# Altium schematic sheet conectic_to_girouette.SchDoc
size B
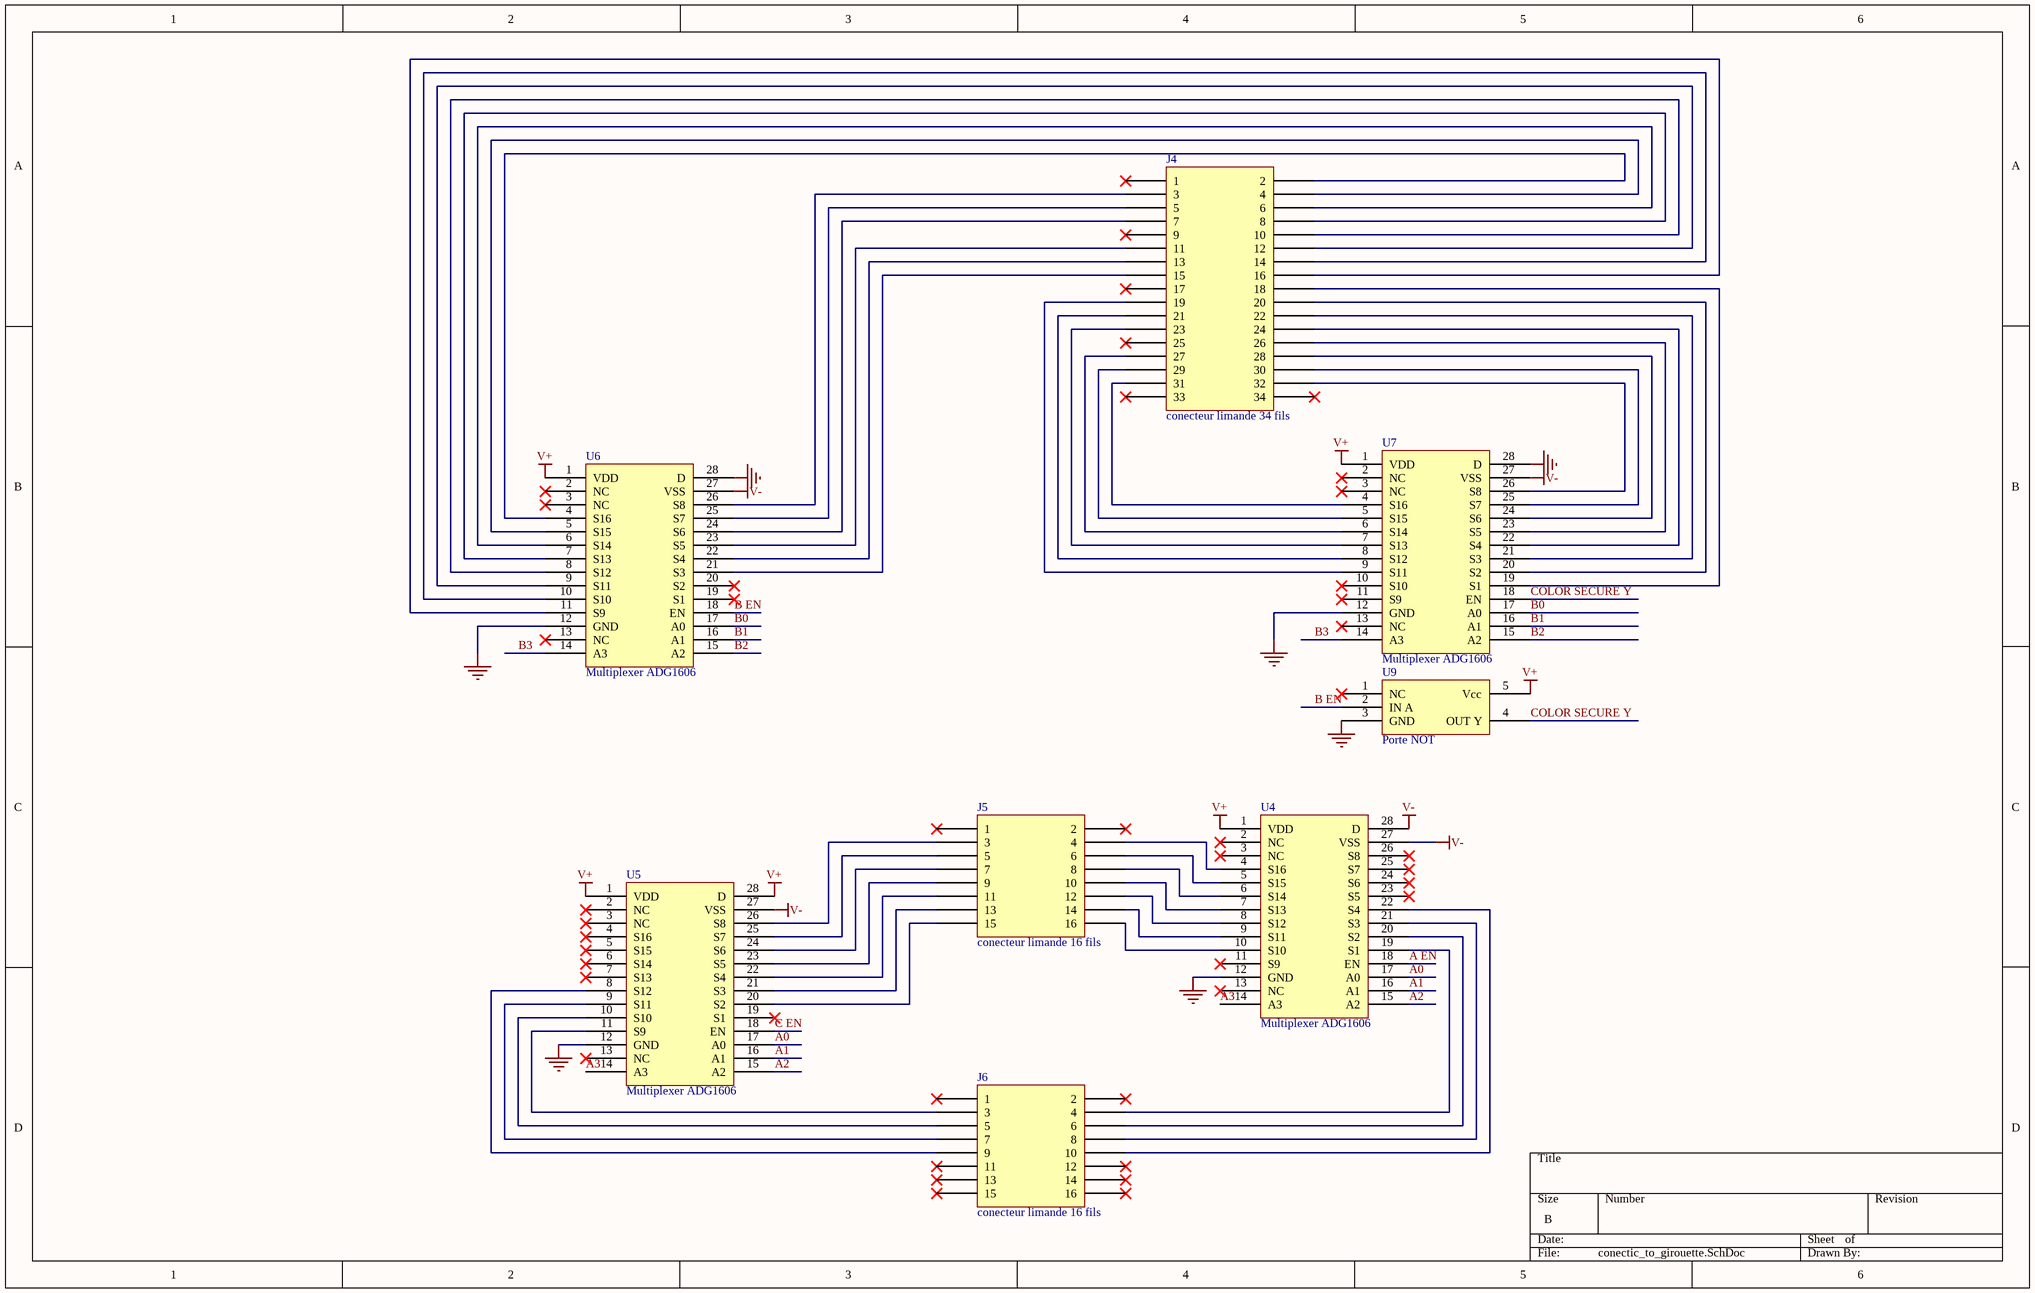
[diagram p0: conectic_to_girouette.SchDoc]

## Parts
J4  conecteur limande 34 fils  [HTSS-117-01-T-DV-P-TR Connecteur 34 pins]
J5  conecteur limande 16 fils  [M80-8541642 connecteur 16 pins]
J6  conecteur limande 16 fils  [M80-8541642 connecteur 16 pins]
U4  Multiplexer ADG1606  [TSOP65P640X120-28N]
U5  Multiplexer ADG1606  [TSOP65P640X120-28N]
U6  Multiplexer ADG1606  [TSOP65P640X120-28N]
U7  Multiplexer ADG1606  [TSOP65P640X120-28N]
U9  Porte NOT  [SOT65P210X110-5N]

## Nets
GND: U4.12(GND) U5.12(GND) U6.12(GND) U6.28(D) U7.12(GND) U7.28(D) U9.3(GND)
V+: U4.1(VDD) U5.1(VDD) U5.28(D) U6.1(VDD) U7.1(VDD) U9.5(Vcc)
V-: U4.27(VSS) U4.28(D) U5.27(VSS) U6.27(VSS) U7.27(VSS)
A0: U4.17(A0) U5.17(A0)
A1: U4.16(A1) U5.16(A1)
A2: U4.15(A2) U5.15(A2)
A3: U4.14(A3) U5.14(A3)
A EN: U4.18(EN)
B0: U6.17(A0) U7.17(A0)
B1: U6.16(A1) U7.16(A1)
B2: U6.15(A2) U7.15(A2)
B3: U6.14(A3) U7.14(A3)
B EN: U6.18(EN) U9.2(IN_A)
C EN: U5.18(EN)
COLOR SECURE Y: U7.18(EN) U9.4(OUT_Y)
NetJ4_2: J4.2 U6.4(S16)
NetJ4_3: J4.3 U6.26(S8)
NetJ4_4: J4.4 U6.5(S15)
NetJ4_5: J4.5 U6.25(S7)
NetJ4_6: J4.6 U6.6(S14)
NetJ4_7: J4.7 U6.24(S6)
NetJ4_8: J4.8 U6.7(S13)
NetJ4_10: J4.10 U6.8(S12)
NetJ4_11: J4.11 U6.23(S5)
NetJ4_12: J4.12 U6.9(S11)
NetJ4_13: J4.13 U6.22(S4)
NetJ4_14: J4.14 U6.10(S10)
NetJ4_15: J4.15 U6.21(S3)
NetJ4_16: J4.16 U6.11(S9)
NetJ4_18: J4.18 U7.19(S1)
NetJ4_19: J4.19 U7.9(S11)
NetJ4_20: J4.20 U7.20(S2)
NetJ4_21: J4.21 U7.8(S12)
NetJ4_22: J4.22 U7.21(S3)
NetJ4_23: J4.23 U7.7(S13)
NetJ4_24: J4.24 U7.22(S4)
NetJ4_26: J4.26 U7.23(S5)
NetJ4_27: J4.27 U7.6(S14)
NetJ4_28: J4.28 U7.24(S6)
NetJ4_29: J4.29 U7.5(S15)
NetJ4_30: J4.30 U7.25(S7)
NetJ4_31: J4.31 U7.4(S16)
NetJ4_32: J4.32 U7.26(S8)
NetJ5_3: J5.3 U5.26(S8)
NetJ5_4: J5.4 U4.4(S16)
NetJ5_5: J5.5 U5.25(S7)
NetJ5_6: J5.6 U4.5(S15)
NetJ5_7: J5.7 U5.24(S6)
NetJ5_8: J5.8 U4.6(S14)
NetJ5_9: J5.9 U5.23(S5)
NetJ5_10: J5.10 U4.7(S13)
NetJ5_11: J5.11 U5.22(S4)
NetJ5_12: J5.12 U4.8(S12)
NetJ5_13: J5.13 U5.21(S3)
NetJ5_14: J5.14 U4.9(S11)
NetJ5_15: J5.15 U5.20(S2)
NetJ5_16: J5.16 U4.10(S10)
NetJ6_3: J6.3 U5.11(S9)
NetJ6_4: J6.4 U4.19(S1)
NetJ6_5: J6.5 U5.10(S10)
NetJ6_6: J6.6 U4.20(S2)
NetJ6_7: J6.7 U5.9(S11)
NetJ6_8: J6.8 U4.21(S3)
NetJ6_9: J6.9 U5.8(S12)
NetJ6_10: J6.10 U4.22(S4)

Not connected (* = marked no-connect by the designer): J4 1* 9* 17* 25* 33* 34*; J5 1* 2*; J6 1* 2* 11* 12* 13* 14* 15* 16*; U4 2(NC)* 3(NC)* 11(S9)* 13(NC)* 23(S5)* 24(S6)* 25(S7)* 26(S8)*; U5 2(NC)* 3(NC)* 4(S16)* 5(S15)* 6(S14)* 7(S13)* 13(NC)* 19(S1)*; U6 2(NC)* 3(NC)* 13(NC)* 19(S1)* 20(S2)*; U7 2(NC)* 3(NC)* 10(S10)* 11(S9)* 13(NC)*; U9 1(NC)*

## Library data of the parts
J4 = Limande 34 fils: fournisseur: Farnell; Ref fabricant: HTSS-117-01-G-D; Ref fournisseur: 1930905
J5 J6 = Connecteur carte a carte: fournisseur: Farnell; Ref fabricant: HTSS-108-02-L-D; Ref fournisseur: 1929447
U4 = Component_1: Ref fabricant: ADG1606BRUZ; Ref fournisseur: 1827328; Fournisseur: Farnell
U5 = Component_1: fournisseur: Farnell; Ref fabricant: ADG1606BRUZ; Ref fournisseur: 1827328
U6 U7 = ADG1606: fournisseur: Farnell; Ref fabricant: ADG1606BRUZ; Ref fournisseur: 1827328
U9 = Porte NOT: fournisseur: Farnell; Ref fabricant: M74VHC1GT04DFT2G; Ref fournisseur: 2464475